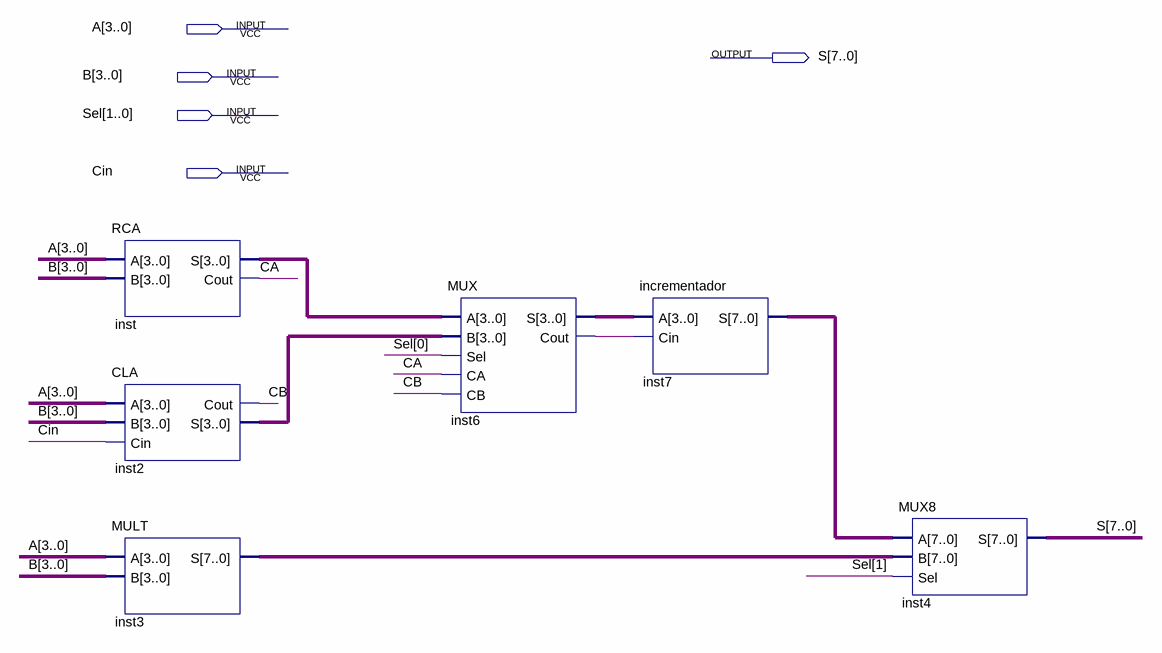
[diagram p0: schematic sheet]
// Quartus schematic ULA.bdf as structural Verilog: 6 symbols, 5 pins
module ULA (
  input  [3:0] A,
  input  [3:0] B,
  input  [1:0] Sel,
  input  Cin,
  output [7:0] S
);

  wire CA, CB, inst6_cout;
  wire [3:0] inst2_s, inst6_s, inst_s;
  wire [7:0] inst3_s, inst7_s;

  RCA inst (.A(A), .B(B), .S(inst_s), .Cout(CA));
  CLA inst2 (.A(A), .B(B), .Cin(Cin), .Cout(CB), .S(inst2_s));
  MULT inst3 (.A(A), .B(B), .S(inst3_s));
  MUX inst6 (.A(inst_s), .B(inst2_s), .Sel(Sel[0]), .CA(CA), .CB(CB), .S(inst6_s), .Cout(inst6_cout));
  incrementador inst7 (.A(inst6_s), .Cin(inst6_cout), .S(inst7_s));
  MUX8 inst4 (.A(inst7_s), .B(inst3_s), .Sel(Sel[1]), .S(S));
endmodule
